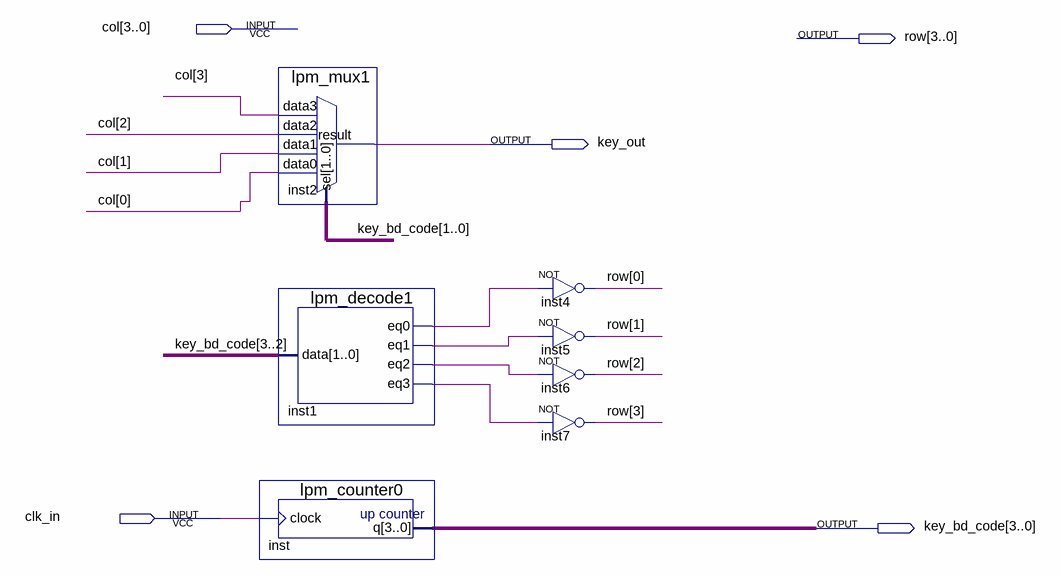
[diagram p0: schematic sheet]
// Quartus schematic key_scan.bdf as structural Verilog: 7 symbols, 5 pins
module key_scan (
  input  [3:0] col,
  input  clk_in,
  output [3:0] row,
  output key_out,
  output [3:0] key_bd_code
);

  wire inst1_eq0, inst1_eq1, inst1_eq2, inst1_eq3;

  lpm_mux1 inst2 (
    .data3(col[3]), .data2(col[2]), .data1(col[1]), .data0(col[0]), .sel(key_bd_code[1:0]), .result(key_out));
  lpm_decode1 inst1 (.data(key_bd_code[3:2]), .eq0(inst1_eq0), .eq1(inst1_eq1), .eq2(inst1_eq2), .eq3(inst1_eq3));
  lpm_counter0 inst (.clock(clk_in), .q(key_bd_code));
  not inst4 (row[0], inst1_eq0);
  not inst5 (row[1], inst1_eq1);
  not inst6 (row[2], inst1_eq2);
  not inst7 (row[3], inst1_eq3);
endmodule
